# Altium schematic sheet CM_FPGA_JTAG_POWER_FLASH.SchDoc
size Tabloid; SheetNumber: 7; SheetTotal: 14; Sheet_Name: CM_FPGA_JTAG_POWER_FLASH; Size: 11x17
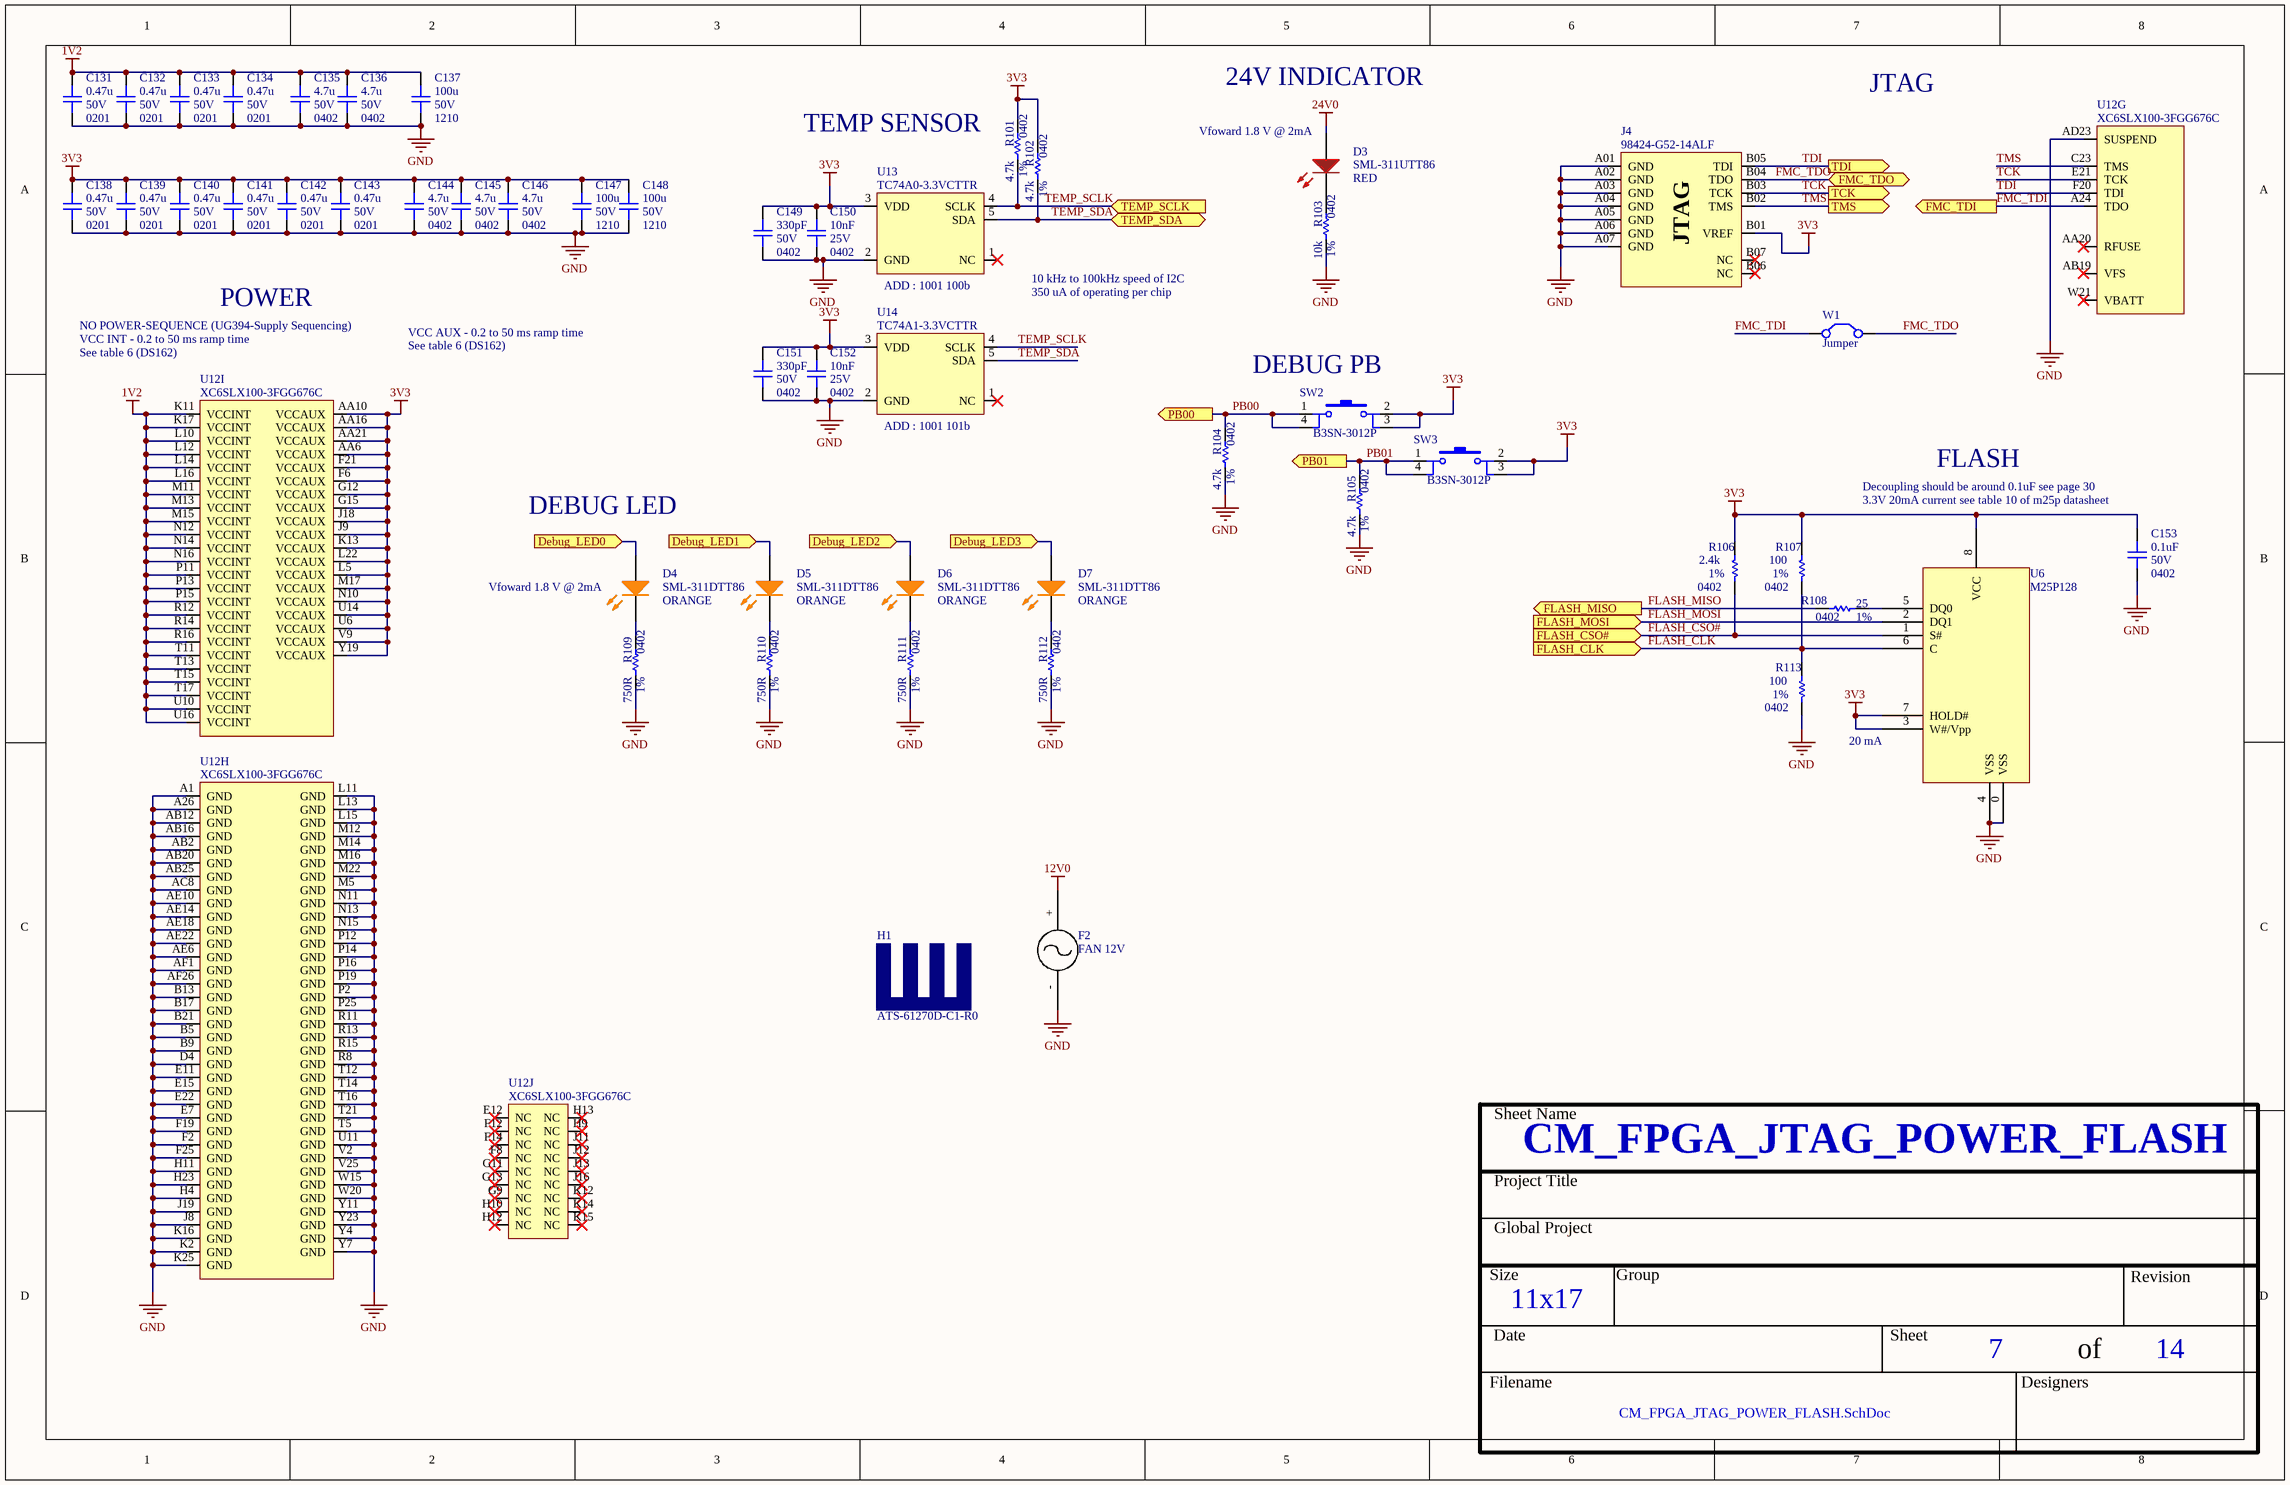
[diagram p0: CM_FPGA_JTAG_POWER_FLASH.SchDoc]

## Parts
C131  value 0.47u  Voltage: 50V  Package: 0201  [CAP_0201]  (hidden comment: CAP - 0201)
C132  value 0.47u  Voltage: 50V  Package: 0201  [CAP_0201]  (hidden comment: CAP - 0201)
C133  value 0.47u  Voltage: 50V  Package: 0201  [CAP_0201]  (hidden comment: CAP - 0201)
C134  value 0.47u  Voltage: 50V  Package: 0201  [CAP_0201]  (hidden comment: CAP - 0201)
C135  value 4.7u  Voltage: 50V  Package: 0402  [CAP_0402]  (hidden comment: CAP - 0402)
C136  value 4.7u  Voltage: 50V  Package: 0402  [CAP_0402]  (hidden comment: CAP - 0402)
C137  value 100u  Voltage: 50V  Package: 1210  [CAP_1210]  (hidden comment: CAP - 1210)
C138  value 0.47u  Voltage: 50V  Package: 0201  [CAP_0201]  (hidden comment: CAP - 0201)
C139  value 0.47u  Voltage: 50V  Package: 0201  [CAP_0201]  (hidden comment: CAP - 0201)
C140  value 0.47u  Voltage: 50V  Package: 0201  [CAP_0201]  (hidden comment: CAP - 0201)
C141  value 0.47u  Voltage: 50V  Package: 0201  [CAP_0201]  (hidden comment: CAP - 0201)
C142  value 0.47u  Voltage: 50V  Package: 0201  [CAP_0201]  (hidden comment: CAP - 0201)
C143  value 0.47u  Voltage: 50V  Package: 0201  [CAP_0201]  (hidden comment: CAP - 0201)
C144  value 4.7u  Voltage: 50V  Package: 0402  [CAP_0402]  (hidden comment: CAP - 0402)
C145  value 4.7u  Voltage: 50V  Package: 0402  [CAP_0402]  (hidden comment: CAP - 0402)
C146  value 4.7u  Voltage: 50V  Package: 0402  [CAP_0402]  (hidden comment: CAP - 0402)
C147  value 100u  Voltage: 50V  Package: 1210  [CAP_1210]  (hidden comment: CAP - 1210)
C148  value 100u  Voltage: 50V  Package: 1210  [CAP_1210]  (hidden comment: CAP - 1210)
C149  value 330pF  Voltage: 50V  Package: 0402  [CAP_0402]  (hidden comment: CAP - 0402)
C150  value 10nF  Voltage: 25V  Package: 0402  [CAP_0402]  (hidden comment: CAP - 0402)
C151  value 330pF  Voltage: 50V  Package: 0402  [CAP_0402]  (hidden comment: CAP - 0402)
C152  value 10nF  Voltage: 25V  Package: 0402  [CAP_0402]  (hidden comment: CAP - 0402)
C153  value 0.1uF  Voltage: 50V  Package: 0402  [CAP_0402]  (hidden comment: CAP - 0402)
D3  SML-311UTT86  value RED  [LED_0603]
D4  SML-311DTT86  value ORANGE  [LED_0603]
D5  SML-311DTT86  value ORANGE  [LED_0603]
D6  SML-311DTT86  value ORANGE  [LED_0603]
D7  SML-311DTT86  value ORANGE  [LED_0603]
F2  FAN 12V  [HDR1X2]
H1  ATS-61270D-C1-R0  [27mm heatsink]
J4  98424-G52-14ALF  [CON_JTAG_98424-G52-14ALF]
R101  value 4.7k  Package: 0402  Precision: 1%  [RES_0402]  (hidden comment: RES - 0402)
R102  value 4.7k  Package: 0402  Precision: 1%  [RES_0402]  (hidden comment: RES - 0402)
R103  value 10k  Package: 0402  Precision: 1%  [RES_0402]  (hidden comment: RES - 0402)
R104  value 4.7k  Package: 0402  Precision: 1%  [RES_0402]  (hidden comment: RES - 0402)
R105  value 4.7k  Package: 0402  Precision: 1%  [RES_0402]  (hidden comment: RES - 0402)
R106  value 2.4k  Package: 0402  Precision: 1%  [RES_0402]  (hidden comment: RES - 0402)
R107  value 100  Package: 0402  Precision: 1%  [RES_0402]  (hidden comment: RES - 0402)
R108  value 25  Package: 0402  Precision: 1%  [RES_0402]  (hidden comment: RES - 0402)
R109  value 750R  Package: 0402  Precision: 1%  [RES_0402]  (hidden comment: RES - 0402)
R110  value 750R  Package: 0402  Precision: 1%  [RES_0402]  (hidden comment: RES - 0402)
R111  value 750R  Package: 0402  Precision: 1%  [RES_0402]  (hidden comment: RES - 0402)
R112  value 750R  Package: 0402  Precision: 1%  [RES_0402]  (hidden comment: RES - 0402)
R113  value 100  Package: 0402  Precision: 1%  [RES_0402]  (hidden comment: RES - 0402)
SW2  B3SN-3012P  [SWI_TACT_B3SN-3012P]
SW3  B3SN-3012P  [SWI_TACT_B3SN-3012P]
U6  M25P128  [M25P128]
U12  XC6SLX100-3FGG676C  [FPGA_XILINX_FGG676]  (parts G,H,I,J of 10)
U13  TC74A0-3.3VCTTR  [SEN_TEMP_TC74A0-3.3VCTTR]
U14  TC74A1-3.3VCTTR  [SEN_TEMP_TC74A0-3.3VCTTR]
W1  Jumper  [RAD-0.2]

## Ports
Debug_LED0 (in), Debug_LED1 (in), Debug_LED2 (in), Debug_LED3 (in), FLASH_CLK (in), FLASH_CSO# (in), FLASH_MISO (out), FLASH_MOSI (in), FMC_TDI (out), FMC_TDO, PB00 (out), PB01 (out), TCK (out), TDI (out), TEMP_SCLK (in), TEMP_SDA (bidir), TMS (out)

## Nets
1V2: C131.2 C132.2 C133.2 C134.2 C135.2 C136.2 C137.2 U12.K11(VCCINT) U12.K17(VCCINT) U12.L10(VCCINT) U12.L12(VCCINT) U12.L14(VCCINT) U12.L16(VCCINT) U12.M11(VCCINT) U12.M13(VCCINT) U12.M15(VCCINT) U12.N12(VCCINT) U12.N14(VCCINT) U12.N16(VCCINT) U12.P11(VCCINT) U12.P13(VCCINT) U12.P15(VCCINT) U12.R12(VCCINT) U12.R14(VCCINT) U12.R16(VCCINT) U12.T11(VCCINT) U12.T13(VCCINT) U12.T15(VCCINT) U12.T17(VCCINT) U12.U10(VCCINT) U12.U16(VCCINT)
3V3: C138.2 C139.2 C140.2 C141.2 C142.2 C143.2 C144.2 C145.2 C146.2 C147.2 C148.2 C149.2 C150.2 C151.2 C152.2 C153.2 J4.B01(VREF) R101.2 R102.2 R106.2 R107.2 SW2.2 SW2.3 SW3.2 SW3.3 U6.3(W#/Vpp) U6.7(HOLD#) U6.8(VCC) U12.AA6(VCCAUX) U12.AA10(VCCAUX) U12.AA16(VCCAUX) U12.AA21(VCCAUX) U12.F6(VCCAUX) U12.F21(VCCAUX) U12.G12(VCCAUX) U12.G15(VCCAUX) U12.J9(VCCAUX) U12.J18(VCCAUX) U12.K13(VCCAUX) U12.L5(VCCAUX) U12.L22(VCCAUX) U12.M17(VCCAUX) U12.N10(VCCAUX) U12.U6(VCCAUX) U12.U14(VCCAUX) U12.V9(VCCAUX) U12.Y19(VCCAUX) U13.3(VDD) U14.3(VDD)
12V0: F2.+
24V0: D3.A
GND: C131.1 C132.1 C133.1 C134.1 C135.1 C136.1 C137.1 C138.1 C139.1 C140.1 C141.1 C142.1 C143.1 C144.1 C145.1 C146.1 C147.1 C148.1 C149.1 C150.1 C151.1 C152.1 C153.1 F2.- J4.A01(GND) J4.A02(GND) J4.A03(GND) J4.A04(GND) J4.A05(GND) J4.A06(GND) J4.A07(GND) R103.1 R104.1 R105.1 R109.1 R110.1 R111.1 R112.1 R113.1 U6.0(VSS) U6.4(VSS) U12.A1(GND) U12.A26(GND) U12.AB2(GND) U12.AB12(GND) U12.AB16(GND) U12.AB20(GND) U12.AB25(GND) U12.AC8(GND) U12.AD23(SUSPEND) U12.AE6(GND) U12.AE10(GND) U12.AE14(GND) U12.AE18(GND) U12.AE22(GND) U12.AF1(GND) U12.AF26(GND) U12.B5(GND) U12.B9(GND) U12.B13(GND) U12.B17(GND) U12.B21(GND) U12.D4(GND) U12.E7(GND) U12.E11(GND) U12.E15(GND) U12.E22(GND) U12.F2(GND) U12.F19(GND) U12.F25(GND) U12.H4(GND) U12.H11(GND) U12.H23(GND) U12.J8(GND) U12.J19(GND) U12.K2(GND) U12.K16(GND) U12.K25(GND) U12.L11(GND) U12.L13(GND) U12.L15(GND) U12.M5(GND) U12.M12(GND) U12.M14(GND) U12.M16(GND) U12.M22(GND) U12.N11(GND) U12.N13(GND) U12.N15(GND) U12.P2(GND) U12.P12(GND) U12.P14(GND) U12.P16(GND) U12.P19(GND) U12.P25(GND) U12.R8(GND) U12.R11(GND) U12.R13(GND) U12.R15(GND) U12.T5(GND) U12.T12(GND) U12.T14(GND) U12.T16(GND) U12.T21(GND) U12.U11(GND) U12.V2(GND) U12.V25(GND) U12.W15(GND) U12.W20(GND) U12.Y4(GND) U12.Y7(GND) U12.Y11(GND) U12.Y23(GND) U13.2(GND) U14.2(GND)
Debug_LED0: D4.A ; port Debug_LED0
Debug_LED1: D5.A ; port Debug_LED1
Debug_LED2: D6.A ; port Debug_LED2
Debug_LED3: D7.A ; port Debug_LED3
FLASH_CLK: R107.1 R113.2 U6.6(C) ; port FLASH_CLK
FLASH_CSO#: R106.1 U6.1(S#) ; port FLASH_CSO#
FLASH_MISO: R108.1 ; port FLASH_MISO
FLASH_MOSI: U6.2(DQ1) ; port FLASH_MOSI
FMC_TDI: U12.A24(TDO) W1.1(C1) ; port FMC_TDI
FMC_TDO: J4.B04(TDO) W1.2(C2) ; port FMC_TDO
PB00: R104.2 SW2.1 SW2.4 ; port PB00
PB01: R105.2 SW3.1 SW3.4 ; port PB01
TCK: J4.B03(TCK) U12.E21(TCK) ; port TCK
TDI: J4.B05(TDI) U12.F20(TDI) ; port TDI
TEMP_SCLK: R101.1 U13.4(SCLK) U14.4(SCLK) ; port TEMP_SCLK
TEMP_SDA: R102.1 U13.5(SDA) U14.5(SDA) ; port TEMP_SDA
TMS: J4.B02(TMS) U12.C23(TMS) ; port TMS
NetD3_K: D3.K R103.2
NetD4_K: D4.K R109.2
NetD5_K: D5.K R110.2
NetD6_K: D6.K R111.2
NetD7_K: D7.K R112.2
NetR108_2: R108.2 U6.5(DQ0)

Not connected (* = marked no-connect by the designer): J4 B06(NC)* B07(NC)*; U12 AA20(RFUSE)* AB19(VFS)* E12(NC)* F8(NC)* F12(NC)* F14(NC)* G9(NC)* G11(NC)* G13(NC)* H9(NC)* H10(NC)* H12(NC)* H13(NC)* J11(NC)* J12(NC)* J13(NC)* J16(NC)* K12(NC)* K14(NC)* K15(NC)* W21(VBATT)*; U13 1(NC)*; U14 1(NC)*

## Notes on the sheet
- 24V INDICATOR
- JTAG
- TEMP SENSOR
- (near D3) Vfoward 1.8 V @ 2mA
- (near U13) ADD : 1001 100b
- 10 kHz to 100kHz speed of I2C
- 350 uA of operating per chip
- VCC INT - 0.2 to 50 ms ramp time
- See table 6 (DS162)
- NO POWER-SEQUENCE (UG394-Supply Sequencing)
- POWER
- VCC AUX - 0.2 to 50 ms ramp time
- (near U14) ADD : 1001 101b
- (near SW2) DEBUG PB
- Decoupling should be around 0.1uF see page 30
- FLASH
- DEBUG LED
- (near C153) 3.3V 20mA current see table 10 of m25p datasheet
- (near D4) Vfoward 1.8 V @ 2mA
- 20 mA
- Sheet Name
- Project Title
- Global Project
- Size
- Group
- Revision
- Date
- Sheet
- of
- Filename
- Designers
- (in symbol CONN_JTAG_98424-G52-14ALF) JTAG

## Library data of the parts
C131-C134 C138-C143 = CAP - 0201: Precision: 10%; Current: *; CreatedBy: Jonathan Bouchard; Power: *
C135 C136 C144-C146 C149-C153 = CAP - 0402: Precision: 10%; Current: *; CreatedBy: Jonathan Bouchard; Power: *
C137 C147 C148 = CAP - 1210: Precision: 10%; Current: *; CreatedBy: Jonathan Bouchard; Power: *
D3 = LED_SML-311UTT86: LED - 620nM RED 2mA - 0603; Voltage: 1.8V; Mfg: ROHM Semiconductor; Power: 44mW; Current: 2mA; HelpURL: http://media.digikey.com/pdf/Data%20Sheets/Rohm%20PDFs/SML-311%20Series.pdf; CreatedBy: Jonathan Bouchard; Temperature: -30°C to 85°C; Package: 0603; Precision: *; Mfg Part Number: SML-311UTT86; Supplier 1: Digikey; Supplier Part Number 1: 511-1304-1-ND
D4-D7 = LED_SML-311DTT86: LED - 611nM ORANGE 2mA - 0603; Voltage: 1.8V; Mfg: ROHM Semiconductor; Power: 44mW; Current: 2mA; HelpURL: http://media.digikey.com/pdf/Data%20Sheets/Rohm%20PDFs/SML-311%20Series.pdf; CreatedBy: Jonathan Bouchard; Temperature: -40°C to 85°C; Package: 0603; Precision: *; Mfg Part Number: SML-311DTT86; Supplier 1: Digikey; Supplier Part Number 1: 511-1303-1-ND
F2 = FAN 12V: pin to pad: +>1 ->2
H1 = ATS-61270D-C1-R0: 27mm Heatsink
J4 = CONN_JTAG_98424-G52-14ALF: CONN -  JTAG HEADER XILINX - 14-SMD; Mfg: Amphenol; Voltage: *; Current: *; Power: *; Mfg Part Number: 98424-G52-14ALF; HelpURL: http://portal.fciconnect.com/Comergent//fci/drawing/98424.pdf; CreatedBy: Jonathan Bouchard; Temperature: *; Value: *; Precision: *; Package: 14-SMD; Supplier 1: Digikey; Supplier Part Number 1: 609-2643-1-ND
R101-R113 = RES - 0402: Voltage: 50V; Power: 1/16W; Current: *; CreatedBy: Jonathan Bouchard
SW2 SW3 = SWI_TACT_B3SN-3012P: SWI - TACT SPST-NO 0.05A 24V - 4-SMD; Current: 50mA; Mfg: Omron; Mfg Part Number: B3SN-3012P; HelpURL: http://www.omron.com/ecb/products/pdf/en-b3sn.pdf; CreatedBy: Jonathan Bouchard; Temperature: -25°C ~ 70°C; Power: *; Precision: *; Package: 4-SMD; Value: *; Voltage: 24V; Supplier 1: Digikey; Supplier Part Number 1: SW261CT-ND
U12 = FPGA_XC6SLX100-3FGG676C: FPGA - XILINX SPARTAN 6 480 I/O - BGA-676; Voltage: 1.14 V ~ 1.26 V; Current: *; Power: *; Mfg: Xilinx; Mfg Part Number: XC6SLX100-3FGG676C; HelpURL: https://www.xilinx.com/support/documentation/data_sheets/ds162.pdf; CreatedBy: Jonathan Bouchard; Temperature: 0°C ~ 85°C (TJ); Value: *; Precision: *; Package: BGA-676; Supplier 1: Digikey; Supplier Part Number 1: 122-1760-ND
U13 U14 = SENS_TEMP_TC74A0-3.3VCTTR: SENS - TEMPERATURE SENSOR I2C/SMBUS - SOT23-5; Voltage: 2.7 V ~ 5.5 V; Mfg: Microchip; Precision: ±2°C (±3°C); Current: *; Power: *; Mfg Part Number: TC74A0-3.3VCTTR; HelpURL: http://ww1.microchip.com/downloads/en/DeviceDoc/21462D.pdf; CreatedBy: Jonathan Bouchard; Temperature: -40°C ~ 125°C; Value: *; Package: SOT23-5; Supplier 1: Digikey; Supplier Part Number 1: TC74A0-3.3VCTDKR-ND
W1 = Jumper: Jumper Wire; Published: 24-Mar-1999; LatestRevisionDate: 17-Jul-2002; LatestRevisionNote: Re-released for DXP Platform.; PackageReference: RAD-0.2; Publisher: Altium Limited; PackageDescription: Radial Cap, Thru-Hole; 2 Leads; 0.2 in Pin Spacing